# Altium schematic sheet Zebra-Modem.SchDoc
size B; Organization: Altium Limited; Address1: L3, 12a Rodborough Rd; Address2: Frenchs Forest; Address3: NSW; Address4: Australia 2086
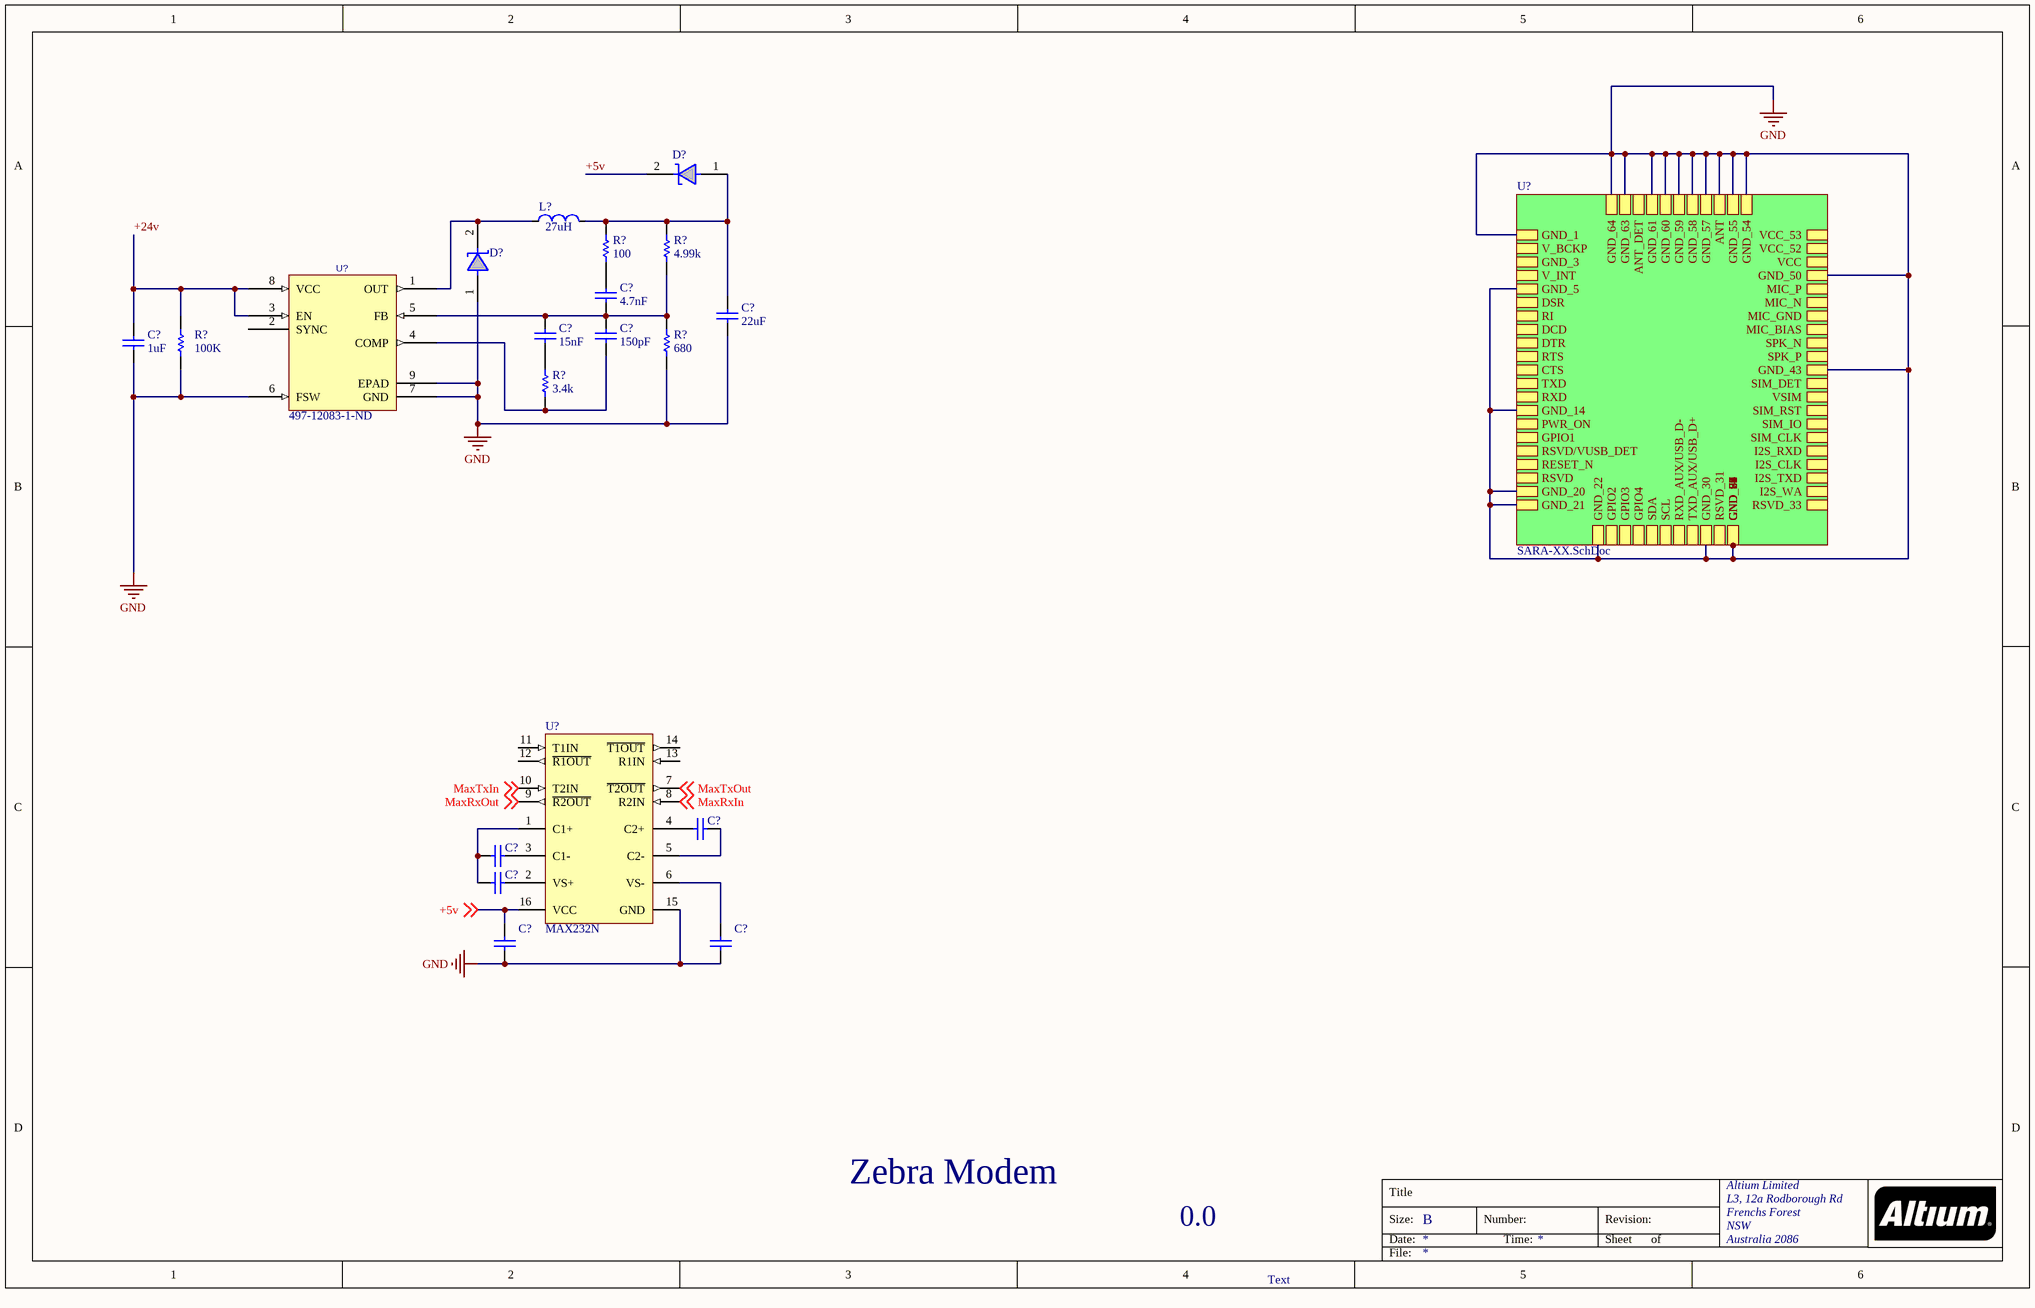
[diagram p0: Zebra-Modem.SchDoc]

## Parts
(Parts that share a designator on the sheet are numbered #1, #2 ... from top to bottom, then left to right.)
C?#1  value 4.7nF  [0603]  (hidden comment: CAP_2)
C?#2  value 22uF  [0603]  (hidden comment: CAP_1_25)
C?#3  value 15nF  [0603]  (hidden comment: CAP_1_17)
C?#4  value 150pF  [0402]  (hidden comment: CAP_1_16)
C?#5  value 1uF  [0402]  (hidden comment: CAP_1_21_3)
C?#6  CAP_1_21_4  [0402]  (value not drawn)
C?#7  CAP_1_21_4  [0402]  (value not drawn)
C?#8  CAP_1_21_4  [0402]  (value not drawn)
C?#9  CAP_1_21_4  [0402]  (value not drawn)
C?#10  CAP_1_21_4  [0402]  (value not drawn)
D?#1  SCHOTTKY DIODE  [SOD323]  (value not drawn)
D?#2  SCHOTTKY DIODE  [SOD323]  (value not drawn)
L?  Inductance: 27uH  [0603]  (hidden comment: INDUCTOR)
R?#1  value 100  [0603]  (hidden comment: RES_9)
R?#2  value 4.99k  [0402]  (hidden comment: RES_38)
R?#3  value 100K  [0402]  (hidden comment: RES_11)
R?#4  value 680  [0402]  (hidden comment: RES_49)
R?#5  value 3.4k  [0603]  (hidden comment: RES_32)
U?#1  Supplier Part Number 1: 497-12083-1-ND  [L7986ATR]  (hidden comment: L7986ATR)
U?#2  MAX232N  [TI-N16]

## Sub-sheets
U? = SARA-XX.SchDoc: GND, GND_66, GND_67, GND_68, GND_69, GND_70, GND_71, GND_72, GND_73, GND_74, GND_75, GND_76, GND_77, GND_78, GND_79, GND_80, GND_81, GND_82, GND_83, GND_84, GND_85, GND_86, GND_87, GND_88, GND_89, GND_90, GND_91, GND_92, GND_93, GND_94, GND_95, GND_96, GND_1, V_BCKP, GND_3, V_INT, GND_5, DSR, RI, DCD, DTR, RTS, CTS, TXD, RXD, GND_14, PWR_ON, GPIO1, RSVD/VUSB_DET, RESET_N, RSVD, GND_20, GND_21, GND_22, GPIO2, GPIO3, GPIO4, SDA, SCL, RXD_AUX/USB_D-, TXD_AUX/USB_D+, GND_30, RSVD_31, GND_32, RSVD_33, I2S_WA, I2S_TXD, I2S_CLK, I2S_RXD, SIM_CLK, SIM_IO, SIM_RST, VSIM, SIM_DET, GND_43, SPK_P, SPK_N, MIC_BIAS, MIC_GND, MIC_N, MIC_P, GND_50, VCC, VCC_52, VCC_53, GND_54, GND_55, ANT, GND_57, GND_58, GND_59, GND_60, GND_61, ANT_DET, GND_63, GND_64

## Nets
GND: C?#2.1 C?#5.1 C?#9.1 C?#10.1 D?#2.1(A) R?#3.2 R?#4.1 U?#1.6(FSW) U?#1.7(GND) U?#1.9(EPAD) U?#2.15(GND) ; sheet U?/GND, sheet U?/GND_66, sheet U?/GND_67, sheet U?/GND_68, sheet U?/GND_69, sheet U?/GND_70, sheet U?/GND_71, sheet U?/GND_72, sheet U?/GND_73, sheet U?/GND_74, sheet U?/GND_75, sheet U?/GND_76, sheet U?/GND_77, sheet U?/GND_78, sheet U?/GND_79, sheet U?/GND_80, sheet U?/GND_81, sheet U?/GND_82, sheet U?/GND_83, sheet U?/GND_84, sheet U?/GND_85, sheet U?/GND_86, sheet U?/GND_87, sheet U?/GND_88, sheet U?/GND_89, sheet U?/GND_90, sheet U?/GND_91, sheet U?/GND_92, sheet U?/GND_93, sheet U?/GND_94, sheet U?/GND_95, sheet U?/GND_96, sheet U?/GND_1, sheet U?/GND_5, sheet U?/GND_14, sheet U?/GND_20, sheet U?/GND_21, sheet U?/GND_22, sheet U?/GND_30, sheet U?/GND_32, sheet U?/GND_43, sheet U?/GND_50, sheet U?/GND_54, sheet U?/GND_55, sheet U?/ANT, sheet U?/GND_57, sheet U?/GND_58, sheet U?/GND_59, sheet U?/GND_60, sheet U?/GND_61, sheet U?/GND_63, sheet U?/GND_64
+5v: C?#9.2 D?#1.2(K) U?#2.16(VCC) ; off-sheet +5v
+24v: C?#5.2 R?#3.1 U?#1.3(EN) U?#1.8(VCC)
MaxRxIn: U?#2.8(R2IN) ; off-sheet MaxRxIn
MaxRxOut: U?#2.9(~{R2OUT}) ; off-sheet MaxRxOut
MaxTxIn: U?#2.10(T2IN) ; off-sheet MaxTxIn
MaxTxOut: U?#2.7(~{T2OUT}) ; off-sheet MaxTxOut
NetC?#1_1: C?#1.1 R?#1.1
NetC?#1_2: C?#1.2 C?#3.2 C?#4.2 R?#2.1 R?#4.2 U?#1.5(FB)
NetC?#2_2: C?#2.2 D?#1.1(A) L?.2 R?#1.2 R?#2.2
NetC?#3_1: C?#3.1 R?#5.2
NetC?#4_1: C?#4.1 R?#5.1 U?#1.4(COMP)
NetC?#6_1: C?#6.1 U?#2.4(C2+)
NetC?#6_2: C?#6.2 U?#2.5(C2-)
NetC?#7_1: C?#7.1 C?#8.1 U?#2.1(C1+)
NetC?#7_2: C?#7.2 U?#2.3(C1-)
NetC?#8_2: C?#8.2 U?#2.2(VS+)
NetC?#10_2: C?#10.2 U?#2.6(VS-)
NetD?#2_2: D?#2.2(K) L?.1 U?#1.1(OUT)

Not connected (* = marked no-connect by the designer): U?#1 2(SYNC); U?#2 11(T1IN) 12(~{R1OUT}) 13(R1IN) 14(~{T1OUT})

## Notes on the sheet
- Zebra Modem
- 0.0
- Text
- Title
- Size:
- Date:
- B
- Number:
- Time:
- Revision:
- Sheet
- of
- File:

## Library data of the parts
C?#1 = CAP_2: 4.7nF 10% 50V; Tolerance: 10%; Voltage: 50V
C?#2 = CAP_1_25: 22uF 20% 6.3V; Tolerance: 20%; Voltage: 6.3V
C?#3 = CAP_1_17: 15nF 10% 50V; Tolerance: 10%; Voltage: 50V
C?#4 = CAP_1_16: 150pF 5% 50V; Tolerance: 5%; Voltage: 50V
C?#5 = CAP_1_21_3: 1uF 10% 50V
C?#6-C?#10 = CAP_1_21_4: 1uF 10% 10V; Tolerance: 10%; Value: 1uF; Voltage: 10V
R?#1 = RES_9: RES 100 0.1W ±1% 0603 (1608); Power: *; Tolerance: *
R?#2 = RES_38: RES 4.99K ±1% 0603 (1608); Power: *; Tolerance: *
R?#3 = RES_11: RES 100K 0.1W ±1% 0603 (1608 Metric)
R?#4 = RES_49: RES 680 ±1% 0603 (1608); Power: *; Tolerance: *
R?#5 = RES_32: RES 3.4K ±1% 0603 (1608); Power: *; Tolerance: *
U?#1 = L7986ATR: IC Switching Regulator 3A STEP-DOWN 8-HSOP; Title: L7986TATR; Supplier 1: Digi-Key
U?#2 = MAX232N: Dual EIA-232 Driver / Receiver, 0 to 70 degC, 16-Pin PDIP (N), Pb-Free (RoHS); SubFamily: RS-232; Drivers Per Package: 2; Supply Voltage(s)(V): 5; ESD HBM(kV): +/-2; ICC(Max)(mA): 10; Single Supply: TRUE; DatasheetVersion: SLLS047L; PackageVersion: revE, Dec-2002; PackageReference: N16; PackageDescription: 16-Pin Plastic Dual-In-Line Package, Row Spacing 7.62 mm, Pitch 2.54 mm; Receivers Per Package: 2; RS-232: TRUE; ComponentLink1Description: Manufacturer URL; ComponentLink1URL: www.ti.com; ComponentLink2Description: Datasheet; ComponentLink2URL: http://www.ti.com/general/docs/lit/getliterature.tsp?genericPartNumber=MAX232&fileType=pdf; ComponentLink3Description: Package Specification; ComponentLink3URL: http://www.ti.com/litv/pdf/mpdi002c
L? = INDUCTOR: Current: *; Resistance: *